# EAGLE schematic distribution_board_f1 (EAGLE 9.0.0)
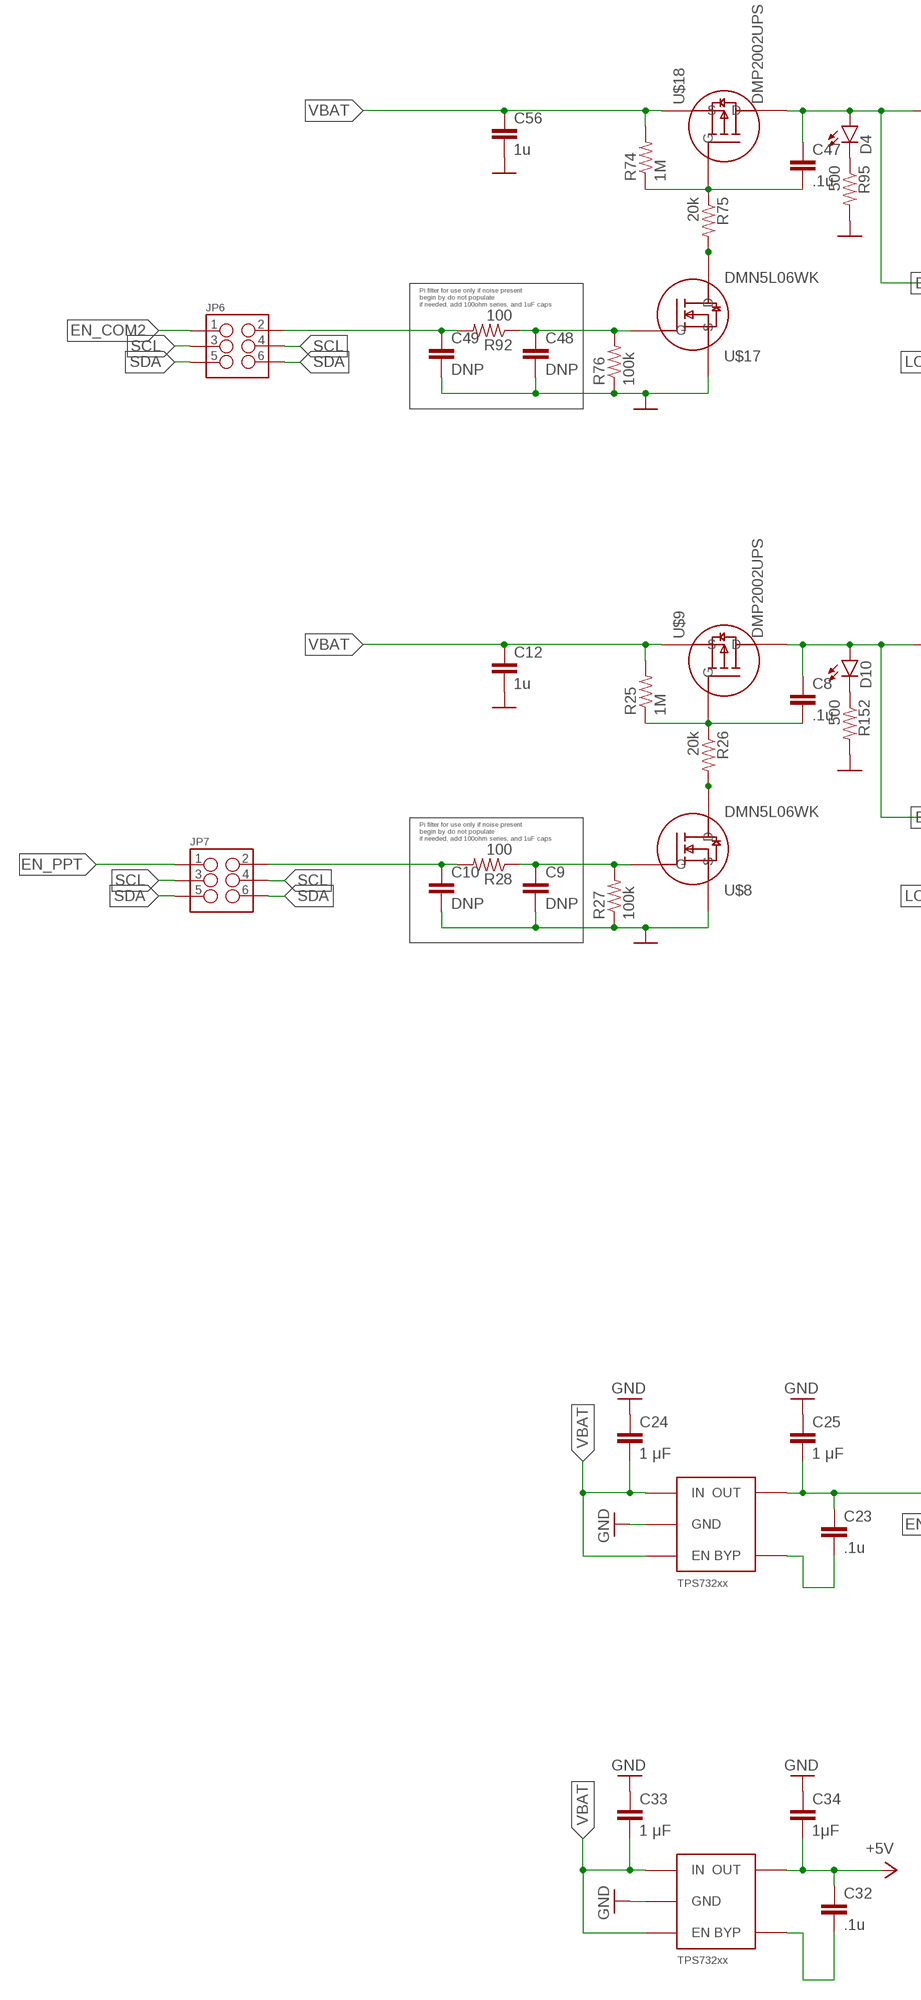
[diagram p0: schematic, sheet 1, part 1 of 3]
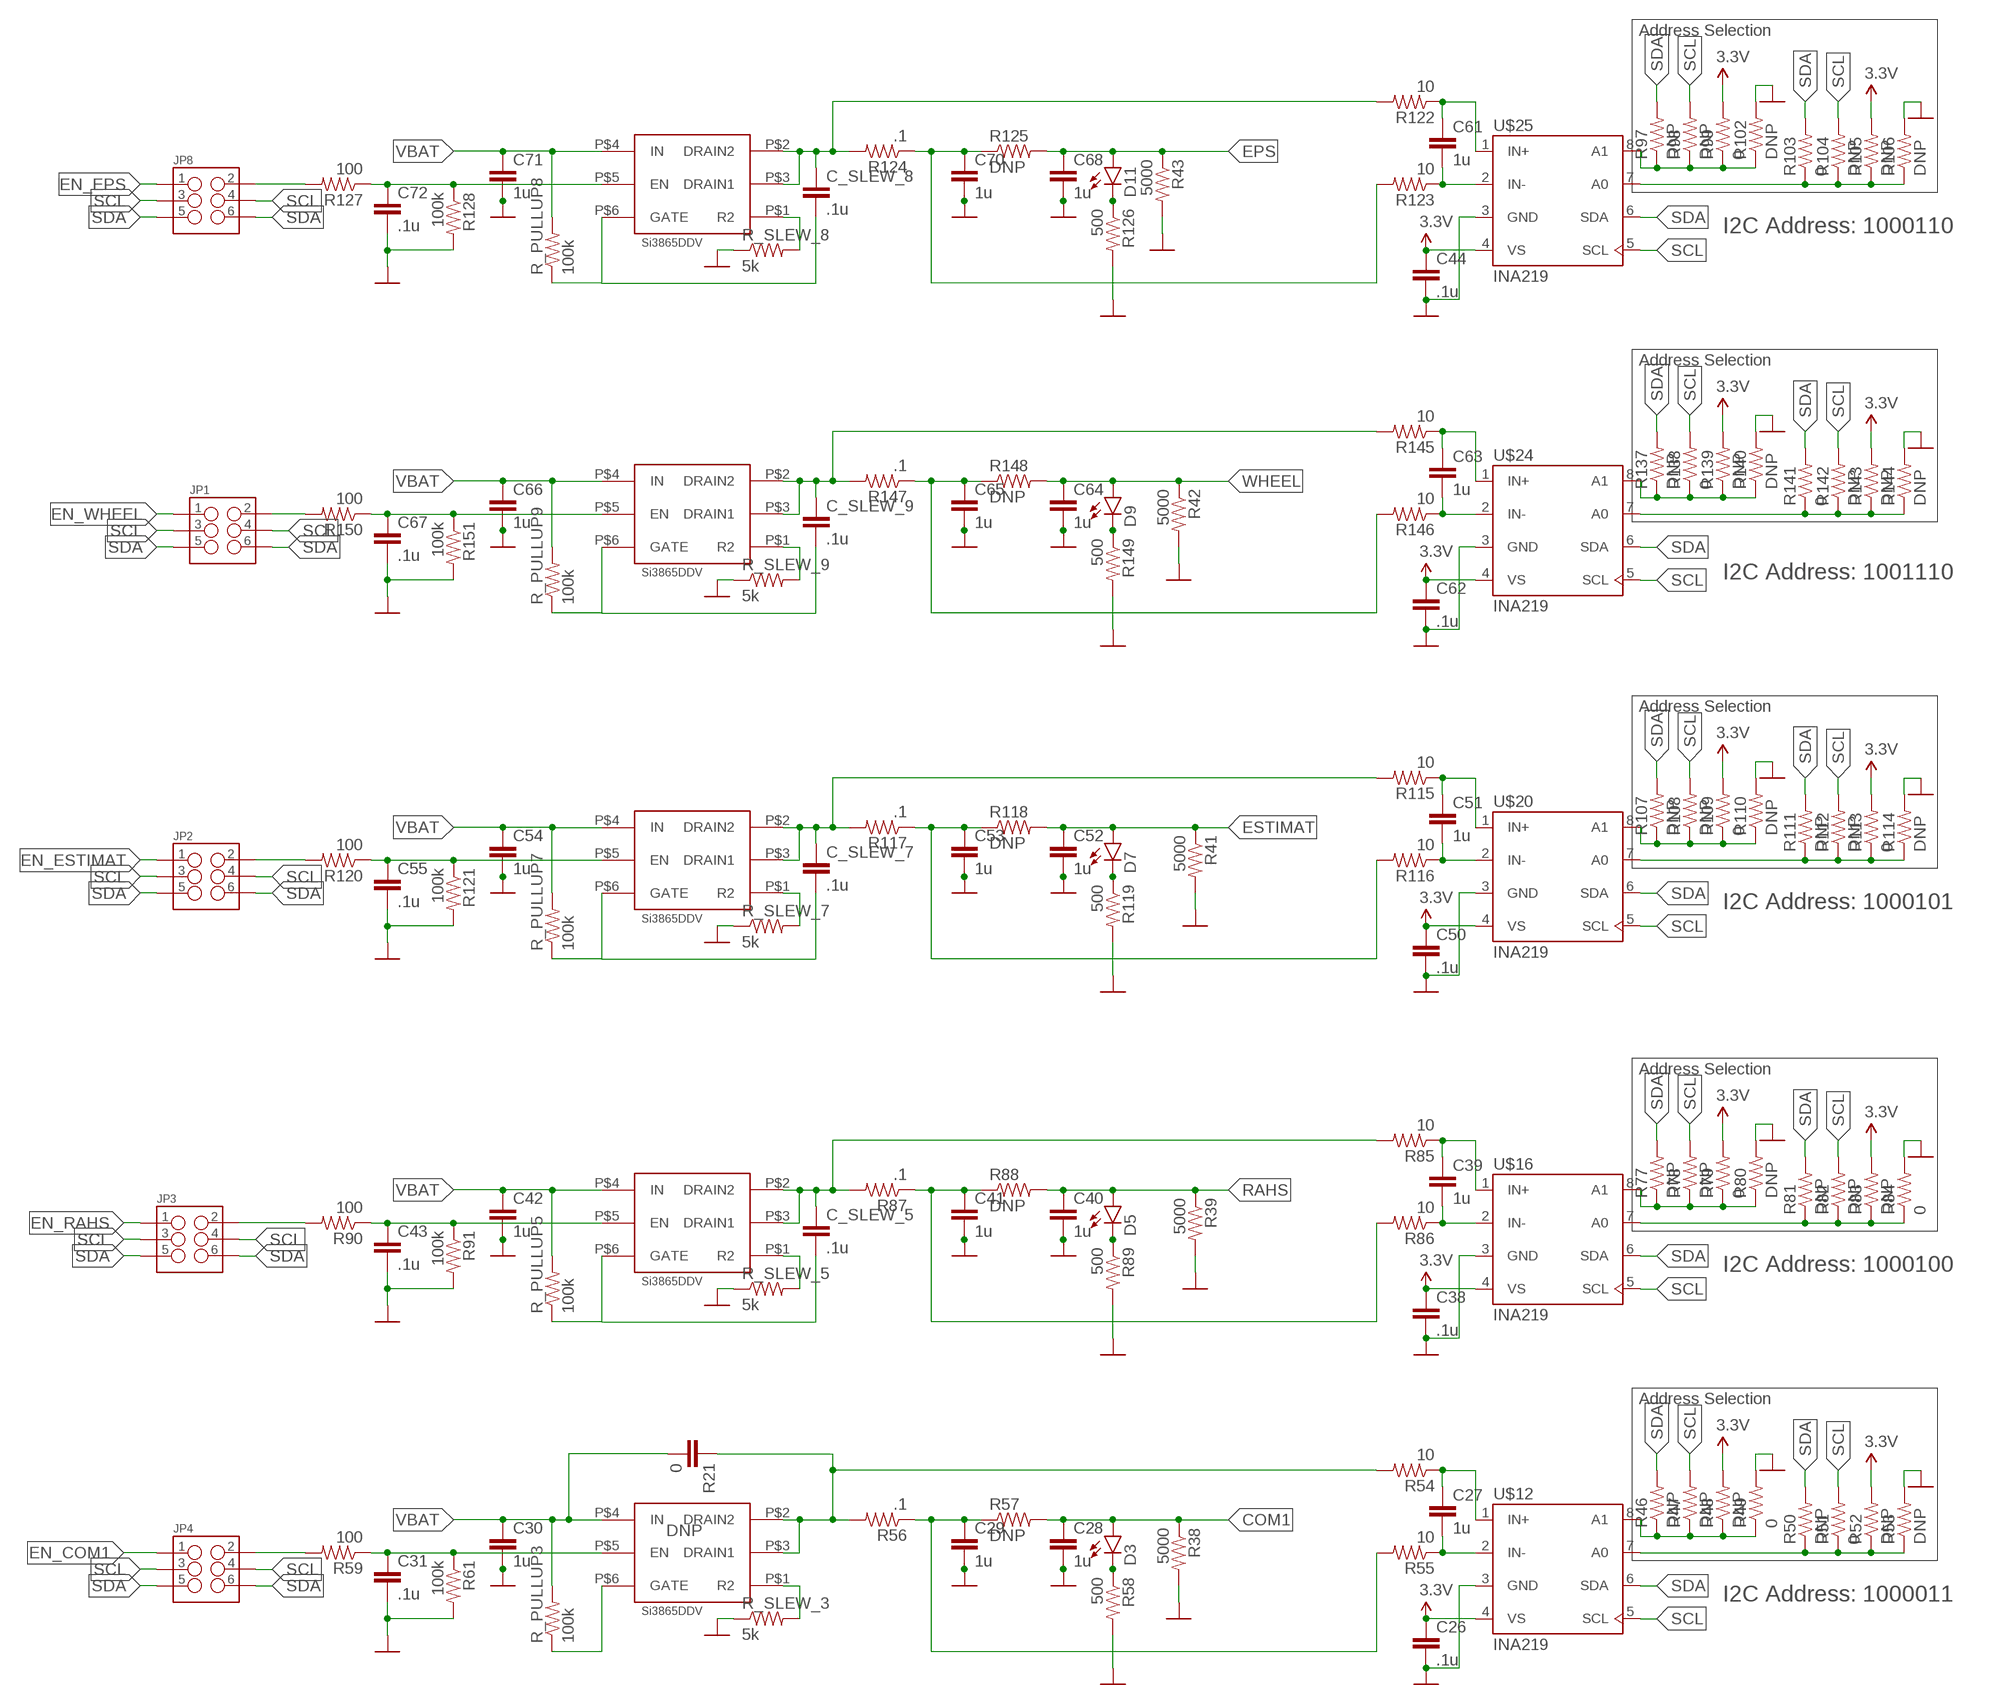
[diagram p1: schematic, sheet 1, part 2 of 3]
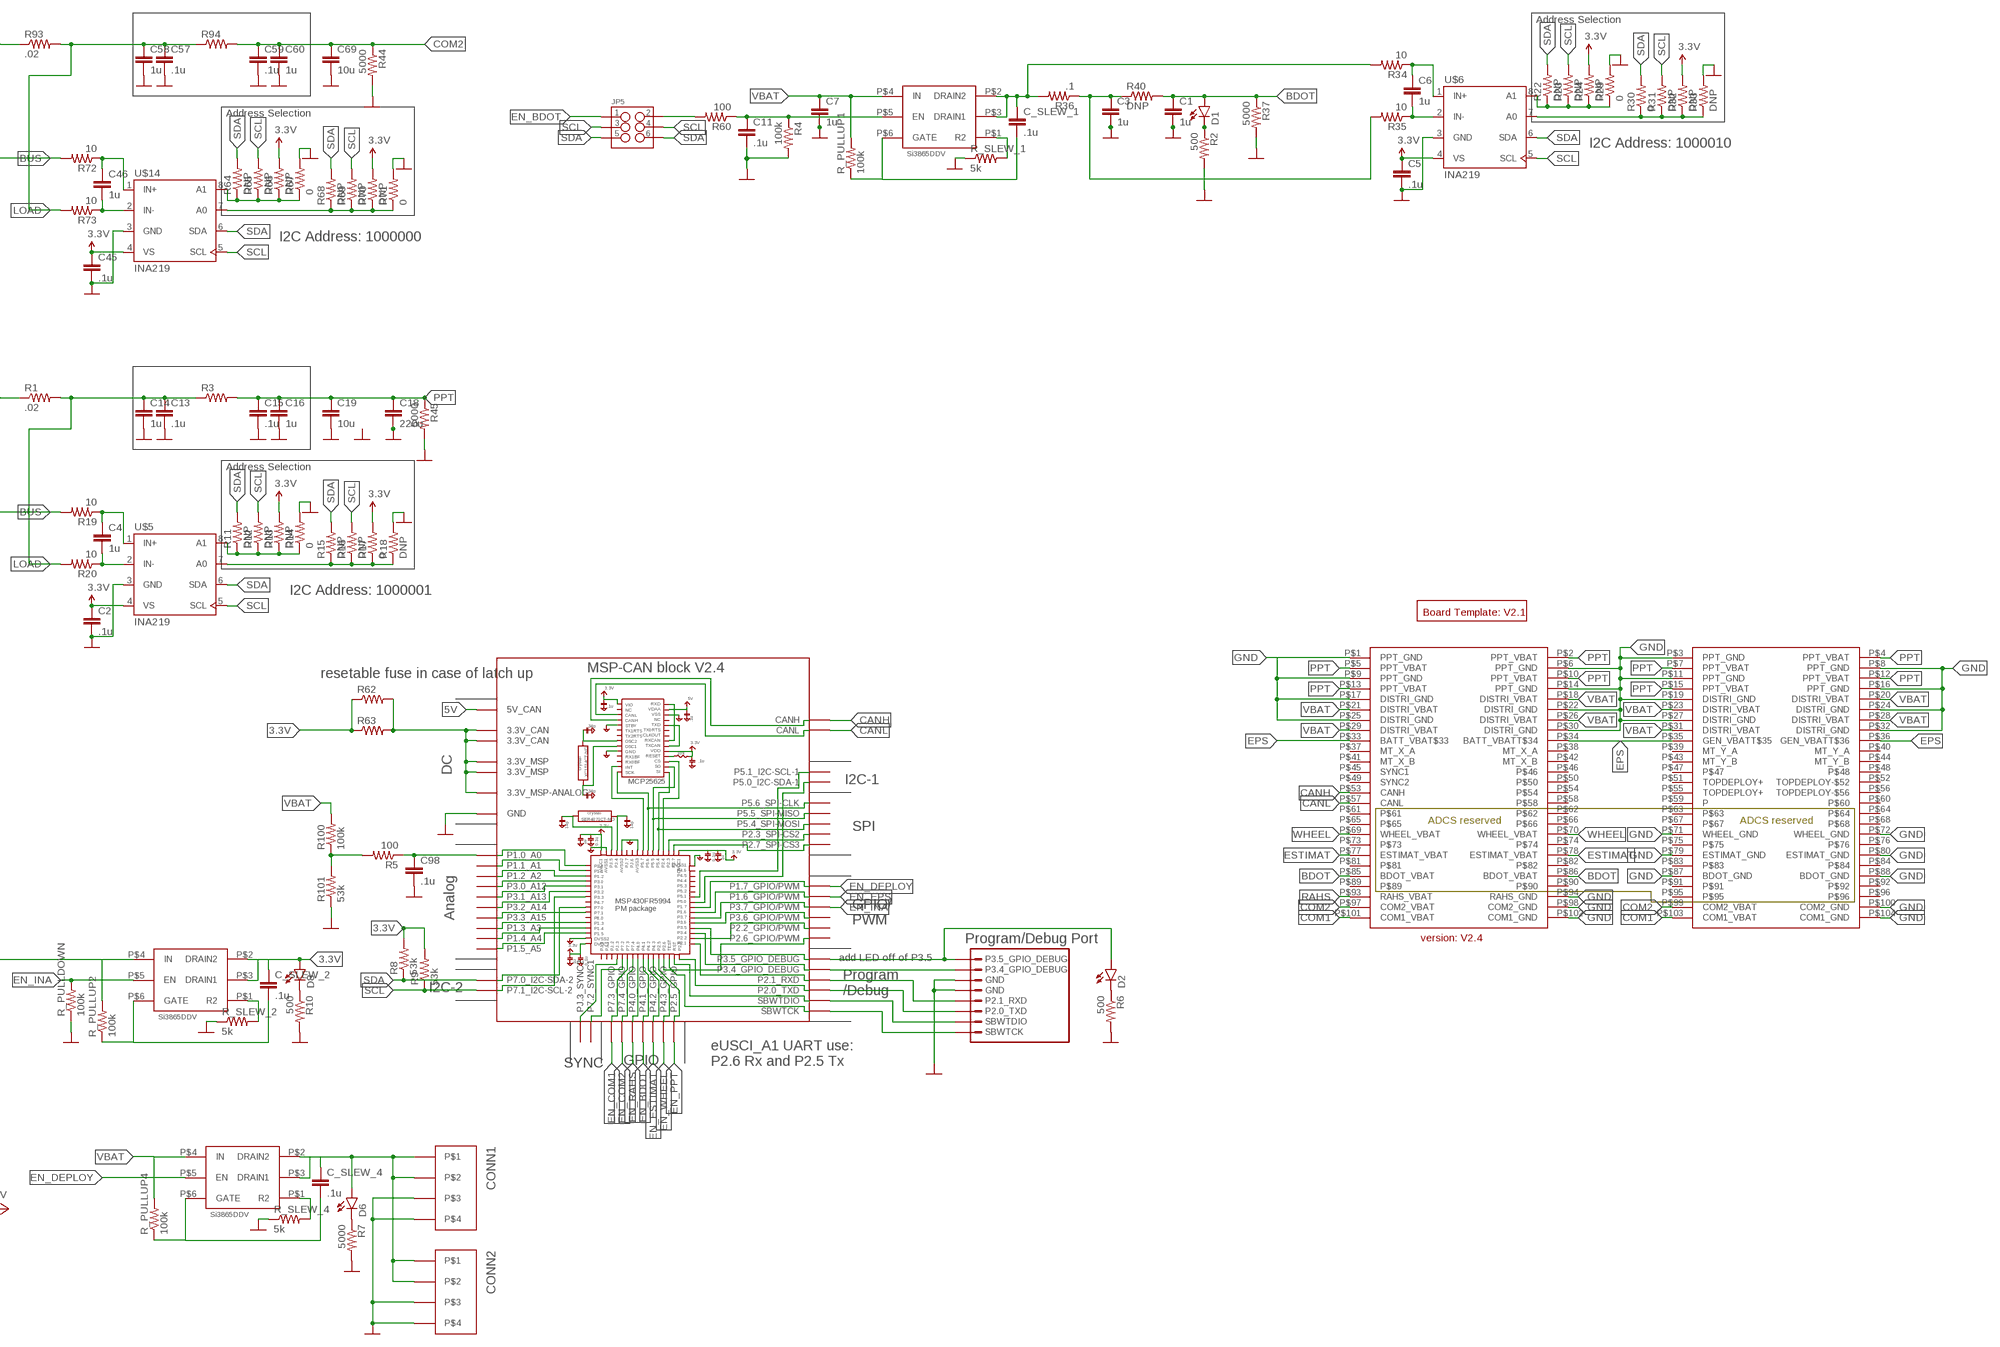
[diagram p2: schematic, sheet 1, part 3 of 3]

## Parts
BLK1  MSP-CAN_BLOCK  [MSP-CAN_BLOCK]
C1  1u  CAPACITOR0805  [0805]
C2  .1u  CAPACITOR0805  [0805]
C3  1u  CAPACITOR0805  [0805]
C4  1u  CAPACITOR0805  [0805]
C5  .1u  CAPACITOR0805  [0805]
C6  1u  CAPACITOR0805  [0805]
C7  1u  CAPACITOR0805  [0805]
C8  .1u  CAPACITOR0805  [0805]
C9  DNP  CAPACITOR0805  [0805]
C10  DNP  CAPACITOR0805  [0805]
C11  .1u  CAPACITOR0805  [0805]
C12  1u  CAPACITOR0805  [0805]
C13  .1u  CAPACITOR0805  [0805]
C14  1u  CAPACITOR0805  [0805]
C15  .1u  CAPACITOR0805  [0805]
C16  1u  CAPACITOR0805  [0805]
C18  220u  CAPACITOR2917  [2917]
C19  10u  CAPACITOR1210  [1210]
C23  .1u  CAPACITOR0805  [0805]
C24  1 μF  CAPACITOR0805  [0805]
C25  1 μF  CAPACITOR0805  [0805]
C26  .1u  CAPACITOR0805  [0805]
C27  1u  CAPACITOR0805  [0805]
C28  1u  CAPACITOR0805  [0805]
C29  1u  CAPACITOR0805  [0805]
C30  1u  CAPACITOR0805  [0805]
C31  .1u  CAPACITOR0805  [0805]
C32  .1u  CAPACITOR0805  [0805]
C33  1 μF  CAPACITOR0805  [0805]
C34  1μF  CAPACITOR0805  [0805]
C38  .1u  CAPACITOR0805  [0805]
C39  1u  CAPACITOR0805  [0805]
C40  1u  CAPACITOR0805  [0805]
C41  1u  CAPACITOR0805  [0805]
C42  1u  CAPACITOR0805  [0805]
C43  .1u  CAPACITOR0805  [0805]
C44  .1u  CAPACITOR0805  [0805]
C45  .1u  CAPACITOR0805  [0805]
C46  1u  CAPACITOR0805  [0805]
C47  .1u  CAPACITOR0805  [0805]
C48  DNP  CAPACITOR0805  [0805]
C49  DNP  CAPACITOR0805  [0805]
C50  .1u  CAPACITOR0805  [0805]
C51  1u  CAPACITOR0805  [0805]
C52  1u  CAPACITOR0805  [0805]
C53  1u  CAPACITOR0805  [0805]
C54  1u  CAPACITOR0805  [0805]
C55  .1u  CAPACITOR0805  [0805]
C56  1u  CAPACITOR0805  [0805]
C57  .1u  CAPACITOR0805  [0805]
C58  1u  CAPACITOR0805  [0805]
C59  .1u  CAPACITOR0805  [0805]
C60  1u  CAPACITOR0805  [0805]
C61  1u  CAPACITOR0805  [0805]
C62  .1u  CAPACITOR0805  [0805]
C63  1u  CAPACITOR0805  [0805]
C64  1u  CAPACITOR0805  [0805]
C65  1u  CAPACITOR0805  [0805]
C66  1u  CAPACITOR0805  [0805]
C67  .1u  CAPACITOR0805  [0805]
C68  1u  CAPACITOR0805  [0805]
C69  10u  CAPACITOR1210  [1210]
C70  1u  CAPACITOR0805  [0805]
C71  1u  CAPACITOR0805  [0805]
C72  .1u  CAPACITOR0805  [0805]
C98  .1u  CAPACITOR0805  [0805]
C_SLEW_1  .1u  CAPACITOR0805  [0805]
C_SLEW_2  .1u  CAPACITOR0805  [0805]
C_SLEW_4  .1u  CAPACITOR0805  [0805]
C_SLEW_5  .1u  CAPACITOR0805  [0805]
C_SLEW_7  .1u  CAPACITOR0805  [0805]
C_SLEW_8  .1u  CAPACITOR0805  [0805]
C_SLEW_9  .1u  CAPACITOR0805  [0805]
CONN1  PICOLOCK_4-LEGACY  [PICOLOCK_4-LEGACY]
CONN2  PICOLOCK_4-LEGACY  [PICOLOCK_4-LEGACY]
D1  LED  [LED-1206]
D2  LED  [LED-1206]
D3  LED  [LED-1206]
D4  LED  [LED-1206]
D5  LED  [LED-1206]
D6  LED  [LED-1206]
D7  LED  [LED-1206]
D8  LED  [LED-1206]
D9  LED  [LED-1206]
D10  LED  [LED-1206]
D11  LED  [LED-1206]
JP1  M03X2NO_SILK  [2X3-NS]
JP2  M03X2NO_SILK  [2X3-NS]
JP3  M03X2NO_SILK  [2X3-NS]
JP4  M03X2NO_SILK  [2X3-NS]
JP5  M03X2NO_SILK  [2X3-NS]
JP6  M03X2NO_SILK  [2X3-NS]
JP7  M03X2NO_SILK  [2X3-NS]
JP8  M03X2NO_SILK  [2X3-NS]
R1  .02  RESISTOR2010  [R2010]
R2  500  RESISTOR0805  [0805]
R3  RESISTOR1206  [1206]
R4  100k  RESISTOR0805  [0805]
R5  100  RESISTOR0805  [0805]
R6  500  RESISTOR0805  [0805]
R7  5000  RESISTOR0805  [0805]
R8  53k  RESISTOR0805  [0805]
R9  53k  RESISTOR0805  [0805]
R10  500  RESISTOR0805  [0805]
R11  DNP  RESISTOR0805  [0805]
R12  DNP  RESISTOR0805  [0805]
R13  DNP  RESISTOR0805  [0805]
R14  0  RESISTOR0805  [0805]
R15  DNP  RESISTOR0805  [0805]
R16  DNP  RESISTOR0805  [0805]
R17  0  RESISTOR0805  [0805]
R18  DNP  RESISTOR0805  [0805]
R19  10  RESISTOR0805  [0805]
R20  10  RESISTOR0805  [0805]
R21  0  CAPACITOR0805  [0805]
R22  DNP  RESISTOR0805  [0805]
R23  DNP  RESISTOR0805  [0805]
R24  DNP  RESISTOR0805  [0805]
R25  1M  RESISTOR0805  [0805]
R26  20k  RESISTOR0805  [0805]
R27  100k  RESISTOR0805  [0805]
R28  100  RESISTOR0805  [0805]
R29  0  RESISTOR0805  [0805]
R30  0  RESISTOR0805  [0805]
R31  DNP  RESISTOR0805  [0805]
R32  DNP  RESISTOR0805  [0805]
R33  DNP  RESISTOR0805  [0805]
R34  10  RESISTOR0805  [0805]
R35  10  RESISTOR0805  [0805]
R36  .1  RESISTOR2010  [R2010]
R37  5000  RESISTOR0805  [0805]
R38  5000  RESISTOR0805  [0805]
R39  5000  RESISTOR0805  [0805]
R40  DNP  RESISTOR0805  [0805]
R41  5000  RESISTOR0805  [0805]
R42  5000  RESISTOR0805  [0805]
R43  5000  RESISTOR0805  [0805]
R44  5000  RESISTOR0805  [0805]
R45  5000  RESISTOR0805  [0805]
R46  DNP  RESISTOR0805  [0805]
R47  DNP  RESISTOR0805  [0805]
R48  DNP  RESISTOR0805  [0805]
R49  0  RESISTOR0805  [0805]
R50  DNP  RESISTOR0805  [0805]
R51  0  RESISTOR0805  [0805]
R52  DNP  RESISTOR0805  [0805]
R53  DNP  RESISTOR0805  [0805]
R54  10  RESISTOR0805  [0805]
R55  10  RESISTOR0805  [0805]
R56  .1  RESISTOR2010  [R2010]
R57  DNP  RESISTOR0805  [0805]
R58  500  RESISTOR0805  [0805]
R59  100  RESISTOR0805  [0805]
R60  100  RESISTOR0805  [0805]
R61  100k  RESISTOR0805  [0805]
R62  RESISTOR0603  [0603]
R63  RESISTOR0805  [0805]
R64  DNP  RESISTOR0805  [0805]
R65  DNP  RESISTOR0805  [0805]
R66  DNP  RESISTOR0805  [0805]
R67  0  RESISTOR0805  [0805]
R68  DNP  RESISTOR0805  [0805]
R69  DNP  RESISTOR0805  [0805]
R70  DNP  RESISTOR0805  [0805]
R71  0  RESISTOR0805  [0805]
R72  10  RESISTOR0805  [0805]
R73  10  RESISTOR0805  [0805]
R74  1M  RESISTOR0805  [0805]
R75  20k  RESISTOR0805  [0805]
R76  100k  RESISTOR0805  [0805]
R77  DNP  RESISTOR0805  [0805]
R78  DNP  RESISTOR0805  [0805]
R79  0  RESISTOR0805  [0805]
R80  DNP  RESISTOR0805  [0805]
R81  DNP  RESISTOR0805  [0805]
R82  DNP  RESISTOR0805  [0805]
R83  DNP  RESISTOR0805  [0805]
R84  0  RESISTOR0805  [0805]
R85  10  RESISTOR0805  [0805]
R86  10  RESISTOR0805  [0805]
R87  .1  RESISTOR2010  [R2010]
R88  DNP  RESISTOR0805  [0805]
R89  500  RESISTOR0805  [0805]
R90  100  RESISTOR0805  [0805]
R91  100k  RESISTOR0805  [0805]
R92  100  RESISTOR0805  [0805]
R93  .02  RESISTOR2010  [R2010]
R94  RESISTOR1206  [1206]
R95  500  RESISTOR0805  [0805]
R97  DNP  RESISTOR0805  [0805]
R98  DNP  RESISTOR0805  [0805]
R99  0  RESISTOR0805  [0805]
R100  100k  RESISTOR0805  [0805]
R101  53k  RESISTOR0805  [0805]
R102  DNP  RESISTOR0805  [0805]
R103  0  RESISTOR0805  [0805]
R104  DNP  RESISTOR0805  [0805]
R105  DNP  RESISTOR0805  [0805]
R106  DNP  RESISTOR0805  [0805]
R107  DNP  RESISTOR0805  [0805]
R108  DNP  RESISTOR0805  [0805]
R109  0  RESISTOR0805  [0805]
R110  DNP  RESISTOR0805  [0805]
R111  DNP  RESISTOR0805  [0805]
R112  DNP  RESISTOR0805  [0805]
R113  0  RESISTOR0805  [0805]
R114  DNP  RESISTOR0805  [0805]
R115  10  RESISTOR0805  [0805]
R116  10  RESISTOR0805  [0805]
R117  .1  RESISTOR2010  [R2010]
R118  DNP  RESISTOR0805  [0805]
R119  500  RESISTOR0805  [0805]
R120  100  RESISTOR0805  [0805]
R121  100k  RESISTOR0805  [0805]
R122  10  RESISTOR0805  [0805]
R123  10  RESISTOR0805  [0805]
R124  .1  RESISTOR2010  [R2010]
R125  DNP  RESISTOR0805  [0805]
R126  500  RESISTOR0805  [0805]
R127  100  RESISTOR0805  [0805]
R128  100k  RESISTOR0805  [0805]
R137  DNP  RESISTOR0805  [0805]
R138  0  RESISTOR0805  [0805]
R139  DNP  RESISTOR0805  [0805]
R140  DNP  RESISTOR0805  [0805]
R141  0  RESISTOR0805  [0805]
R142  DNP  RESISTOR0805  [0805]
R143  DNP  RESISTOR0805  [0805]
R144  DNP  RESISTOR0805  [0805]
R145  10  RESISTOR0805  [0805]
R146  10  RESISTOR0805  [0805]
R147  .1  RESISTOR2010  [R2010]
R148  DNP  RESISTOR0805  [0805]
R149  500  RESISTOR0805  [0805]
R150  100  RESISTOR0805  [0805]
R151  100k  RESISTOR0805  [0805]
R152  500  RESISTOR0805  [0805]
R_PULLDOWN  100k  RESISTOR0805  [0805]
R_PULLUP1  100k  RESISTOR0805  [0805]
R_PULLUP2  100k  RESISTOR0805  [0805]
R_PULLUP3  100k  RESISTOR0805  [0805]
R_PULLUP4  100k  RESISTOR0805  [0805]
R_PULLUP5  100k  RESISTOR0805  [0805]
R_PULLUP7  100k  RESISTOR0805  [0805]
R_PULLUP8  100k  RESISTOR0805  [0805]
R_PULLUP9  100k  RESISTOR0805  [0805]
R_SLEW_1  5k  RESISTOR0805  [0805]
R_SLEW_2  5k  RESISTOR0805  [0805]
R_SLEW_3  5k  RESISTOR0805  [0805]
R_SLEW_4  5k  RESISTOR0805  [0805]
R_SLEW_5  5k  RESISTOR0805  [0805]
R_SLEW_7  5k  RESISTOR0805  [0805]
R_SLEW_8  5k  RESISTOR0805  [0805]
R_SLEW_9  5k  RESISTOR0805  [0805]
U2  TPS732XX  [SOT-23-5]
U3  TPS732XX  [SOT-23-5]
U$1  PROGRAM/DEBUG_PORT  [1X08_CONNECTOR]
U$2  PC104_CONNECTOR  [PC104_CONNECTOR]
U$3  BOARD_TEMPLATE1  [BOARD_TEMPLATE]
U$5  INA219  [SOT-23-8]
U$6  INA219  [SOT-23-8]
U$7  SI3865DDV  [TSOP-6]
U$8  DMN5L06WK  [SOT-323]
U$9  DMP2002UPS  [POWERDI5060-8]
U$10  SI3865DDV  [TSOP-6]
U$11  SI3865DDV  [TSOP-6]
U$12  INA219  [SOT-23-8]
U$13  SI3865DDV  [TSOP-6]
U$14  INA219  [SOT-23-8]
U$15  SI3865DDV  [TSOP-6]
U$16  INA219  [SOT-23-8]
U$17  DMN5L06WK  [SOT-323]
U$18  DMP2002UPS  [POWERDI5060-8]
U$19  SI3865DDV  [TSOP-6]
U$20  INA219  [SOT-23-8]
U$22  SI3865DDV  [TSOP-6]
U$23  SI3865DDV  [TSOP-6]
U$24  INA219  [SOT-23-8]
U$25  INA219  [SOT-23-8]

## Nets
3.3V: BLK1.3.3V@CAN1(3.3V_CAN) BLK1.3.3V@CAN2(3.3V_CAN) BLK1.3.3V@MSP1(3.3V_MSP) BLK1.3.3V@MSP2(3.3V_MSP) BLK1.3.3V_ANALOG@MSP2(3.3V_MSP-ANALOG) C2.1 C5.1 C23.1 C25.2 C26.1 C38.1 C44.1 C45.1 C50.1 C62.1 C_SLEW_2.1 D8.A R8.2 R9.2 R13.2 R17.2 R24.2 R32.2 R48.2 R52.2 R62.1 R62.2 R63.1 R63.2 R66.2 R70.2 R79.2 R83.2 R99.2 R105.2 R109.2 R113.2 R139.2 R143.2 R_PULLUP2.2 U2.P$5(OUT) U$5.4(VS) U$6.4(VS) U$7.P$2(DRAIN2) U$7.P$3(DRAIN1) U$7.P$4(IN) U$12.4(VS) U$14.4(VS) U$16.4(VS) U$20.4(VS) U$24.4(VS) U$25.4(VS)
5V: BLK1.5V(5V_CAN) C32.1 C34.2 U3.P$5(OUT) ; supply symbol labelled +5V
BDOT: C1.1 D1.A R37.1 R40.2 U$2.P$85(BDOT_VBAT) U$2.P$86(BDOT_VBAT)
BUS: C8.1 C47.1 D4.A D10.A R1.1 R19.2 R72.2 R93.1 U$9.D1(D) U$9.D2(D) U$9.D3(D) U$9.D4(D) U$9.D5(D) U$18.D1(D) U$18.D2(D) U$18.D3(D) U$18.D4(D) U$18.D5(D)
CANH: BLK1.CANH U$2.P$53(CANH)
CANL: BLK1.CANL U$2.P$57(CANL)
COM1: C28.1 D3.A R38.1 R57.2 U$2.P$101(COM1_VBAT) U$2.P$103(COM1_VBAT)
COM2: C59.1 C60.1 C69.1 R44.1 R94.2 U$2.P$97(COM2_VBAT) U$2.P$99(COM2_VBAT)
DEPLOY: C_SLEW_4.1 CONN1.P$1 CONN1.P$2 CONN2.P$1 CONN2.P$2 D6.A U$13.P$2(DRAIN2) U$13.P$3(DRAIN1)
EN_BDOT: BLK1.P4.1_GPIO JP5.1 JP5.2 R60.2
EN_COM1: BLK1.P7.3_GPIO JP4.1 JP4.2 R59.2
EN_COM2: BLK1.P7.4_GPIO C49.1 JP6.1 JP6.2 R92.2
EN_DEPLOY: BLK1.P1.7_GPIO/PWM U$13.P$5(EN)
EN_EPS: BLK1.P1.6_GPIO/PWM JP8.1 JP8.2 R127.2
EN_ESTIMAT: BLK1.P4.2_GPIO JP2.1 JP2.2 R120.2
EN_INA: BLK1.P3.7_GPIO/PWM R_PULLDOWN.2 U$7.P$5(EN)
EN_PPT: BLK1.P2.5_GPIO C10.1 JP7.1 JP7.2 R28.2
EN_RAHS: BLK1.P4.0_GPIO JP3.1 JP3.2 R90.2
EN_WHEEL: BLK1.P4.3_GPIO JP1.1 JP1.2 R150.2
EPS: C68.1 D11.A R43.1 R125.2 U$2.P$33(BATT_VBAT$33) U$2.P$34(BATT_VBATT$34) U$2.P$35(GEN_VBATT$35) U$2.P$36(GEN_VBATT$36)
ESTIMAT: C52.1 D7.A R41.1 R118.2 U$2.P$77(ESTIMAT_VBAT) U$2.P$78(ESTIMAT_VBAT)
GND: BLK1.GND@1(GND) BLK1.GND@2(GND) BLK1.GND@3(GND) BLK1.GND@4(GND) BLK1.GND@5(GND) BLK1.GND@7(GND) BLK1.GND@8(GND) BLK1.GND@9(GND) BLK1.GND@10(GND) BLK1.GND@11(GND) BLK1.GND@12(GND) BLK1.GND@13(GND) BLK1.GND@14(GND) BLK1.GND@15(GND) BLK1.GND@16(GND) BLK1.GND@17(GND) BLK1.GND@26(GND) C1.2 C2.2 C3.2 C5.2 C7.2 C9.2 C10.2 C11.2 C12.2 C13.2 C14.2 C15.2 C16.2 C18.2 C19.2 C24.1 C25.1 C26.2 C28.2 C29.2 C30.2 C31.2 C33.1 C34.1 C38.2 C40.2 C41.2 C42.2 C43.2 C44.2 C45.2 C48.2 C49.2 C50.2 C52.2 C53.2 C54.2 C55.2 C56.2 C57.2 C58.2 C59.2 C60.2 C62.2 C64.2 C65.2 C66.2 C67.2 C68.2 C69.2 C70.2 C71.2 C72.2 C98.2 CONN1.P$3 CONN1.P$4 CONN2.P$3 CONN2.P$4 R2.2 R4.2 R6.2 R7.2 R10.2 R14.2 R18.2 R27.1 R29.2 R33.2 R37.2 R38.2 R39.2 R41.2 R42.2 R43.2 R44.2 R45.2 R49.2 R53.2 R58.2 R61.2 R67.2 R71.2 R76.1 R80.2 R84.2 R89.2 R91.2 R95.2 R101.1 R102.2 R106.2 R110.2 R114.2 R119.2 R121.2 R126.2 R128.2 R140.2 R144.2 R149.2 R151.2 R152.2 R_PULLDOWN.1 R_SLEW_1.1 R_SLEW_2.1 R_SLEW_3.1 R_SLEW_4.1 R_SLEW_5.1 R_SLEW_7.1 R_SLEW_8.1 R_SLEW_9.1 U2.P$2(GND) U3.P$2(GND) U$1.5(GND) U$1.6(GND) U$2.P$1(PPT_GND) U$2.P$3(PPT_GND) U$2.P$6(PPT_GND) U$2.P$8(PPT_GND) U$2.P$9(PPT_GND) U$2.P$11(PPT_GND) U$2.P$14(PPT_GND) U$2.P$16(PPT_GND) U$2.P$17(DISTRI_GND) U$2.P$19(DISTRI_GND) U$2.P$22(DISTRI_GND) U$2.P$24(DISTRI_GND) U$2.P$27(DISTRI_GND) U$2.P$30(DISTRI_GND) U$2.P$32(DISTRI_GND) U$2.P$71(WHEEL_GND) U$2.P$72(WHEEL_GND) U$2.P$79(ESTIMAT_GND) U$2.P$80(ESTIMAT_GND) U$2.P$87(BDOT_GND) U$2.P$88(BDOT_GND) U$2.P$94(RAHS_GND) U$2.P$98(COM2_GND) U$2.P$100(COM2_GND) U$2.P$102(COM1_GND) U$2.P$104(COM1_GND) U$5.3(GND) U$6.3(GND) U$8.2(S) U$12.3(GND) U$14.3(GND) U$16.3(GND) U$17.2(S) U$20.3(GND) U$24.3(GND) U$25.3(GND) ; supply symbol labelled DGND
INA219_A0_1: R15.1 R16.1 R17.1 R18.1 U$5.7(A0)
INA219_A0_2: R30.1 R31.1 R32.1 R33.1 U$6.7(A0)
INA219_A0_4: R50.1 R51.1 R52.1 R53.1 U$12.7(A0)
INA219_A0_5: R68.1 R69.1 R70.1 R71.1 U$14.7(A0)
INA219_A0_6: R81.1 R82.1 R83.1 R84.1 U$16.7(A0)
INA219_A0_7: R103.1 R104.1 R105.1 R106.1 U$25.7(A0)
INA219_A0_8: R111.1 R112.1 R113.1 R114.1 U$20.7(A0)
INA219_A0_10: R141.1 R142.1 R143.1 R144.1 U$24.7(A0)
INA219_A1_1: R11.1 R12.1 R13.1 R14.1 U$5.8(A1)
INA219_A1_2: R22.1 R23.1 R24.1 R29.1 U$6.8(A1)
INA219_A1_4: R46.1 R47.1 R48.1 R49.1 U$12.8(A1)
INA219_A1_5: R64.1 R65.1 R66.1 R67.1 U$14.8(A1)
INA219_A1_6: R77.1 R78.1 R79.1 R80.1 U$16.8(A1)
INA219_A1_7: R97.1 R98.1 R99.1 R102.1 U$25.8(A1)
INA219_A1_8: R107.1 R108.1 R109.1 R110.1 U$20.8(A1)
INA219_A1_10: R137.1 R138.1 R139.1 R140.1 U$24.8(A1)
INA219_IN+_1: C4.1 R19.1 U$5.1(IN+)
INA219_IN+_2: C6.1 R34.1 U$6.1(IN+)
INA219_IN+_4: C27.1 R54.1 U$12.1(IN+)
INA219_IN+_5: C46.1 R72.1 U$14.1(IN+)
INA219_IN+_6: C39.1 R85.1 U$16.1(IN+)
INA219_IN+_7: C61.1 R122.1 U$25.1(IN+)
INA219_IN+_8: C51.1 R115.1 U$20.1(IN+)
INA219_IN+_10: C63.1 R145.1 U$24.1(IN+)
INA219_IN-_1: C4.2 R20.1 U$5.2(IN-)
INA219_IN-_2: C6.2 R35.1 U$6.2(IN-)
INA219_IN-_4: C27.2 R55.1 U$12.2(IN-)
INA219_IN-_5: C46.2 R73.1 U$14.2(IN-)
INA219_IN-_6: C39.2 R86.1 U$16.2(IN-)
INA219_IN-_7: C61.2 R123.1 U$25.2(IN-)
INA219_IN-_8: C51.2 R116.1 U$20.2(IN-)
INA219_IN-_10: C63.2 R146.1 U$24.2(IN-)
LDO_3V3_BYP2: C23.2 U2.P$4(BYP)
LDO_5V_BYP2: C32.2 U3.P$4(BYP)
LOAD: C13.1 C14.1 C57.1 C58.1 R1.2 R3.1 R20.2 R73.2 R93.2 R94.1
N$1: C8.2 R25.1 R26.1 U$9.G
N$2: C9.1 R27.2 R28.1 U$8.1(G)
N$3: D1.C R2.1
N$4: C11.1 R4.1 R60.1 U$11.P$5(EN)
N$5: R5.2 R100.1 R101.2
N$6: R26.2 U$8.3(D)
N$7: BLK1.P1.0_A0 C98.1 R5.1
N$8: R_SLEW_2.2 U$7.P$1(R2)
N$9: R_SLEW_1.2 U$11.P$1(R2)
N$10: C_SLEW_1.2 R_PULLUP1.1 U$11.P$6(GATE)
N$11: C_SLEW_2.2 R_PULLUP2.1 U$7.P$6(GATE)
N$12: R_SLEW_3.2 U$10.P$1(R2)
N$13: R_PULLUP3.1 U$10.P$6(GATE)
N$14: D3.C R58.1
N$15: C31.1 R59.1 R61.1 U$10.P$5(EN)
N$16: C47.2 R74.1 R75.1 U$18.G
N$17: C48.1 R76.2 R92.1 U$17.1(G)
N$18: R75.2 U$17.3(D)
N$19: D4.C R95.1
N$20: R_SLEW_5.2 U$15.P$1(R2)
N$21: C_SLEW_5.2 R_PULLUP5.1 U$15.P$6(GATE)
N$22: D5.C R89.1
N$23: C43.1 R90.1 R91.1 U$15.P$5(EN)
N$24: BLK1.P3.5_GPIO_DEBUG D2.A U$1.8(P3.5_GPIO_DEBUG)
N$25: BLK1.P3.4_GPIO_DEBUG U$1.7(P3.4_GPIO_DEBUG)
N$26: BLK1.P2.1_RXD U$1.4(P2.1_RXD)
N$27: BLK1.P2.0_TXD U$1.3(P2.0_TXD)
N$28: R_SLEW_7.2 U$19.P$1(R2)
N$29: C_SLEW_7.2 R_PULLUP7.1 U$19.P$6(GATE)
N$30: D7.C R119.1
N$31: C55.1 R120.1 R121.1 U$19.P$5(EN)
N$32: BLK1.SBWTDIO U$1.2(SBWTDIO)
N$33: BLK1.SBWTCK U$1.SBWTCK
N$34: R_SLEW_4.2 U$13.P$1(R2)
N$35: C_SLEW_4.2 R_PULLUP4.1 U$13.P$6(GATE)
N$36: R_SLEW_9.2 U$23.P$1(R2)
N$37: C_SLEW_9.2 R_PULLUP9.1 U$23.P$6(GATE)
N$38: D9.C R149.1
N$39: C67.1 R150.1 R151.1 U$23.P$5(EN)
N$40: D10.C R152.1
N$43: D2.C R6.1
N$44: D8.C R10.1
N$45: D6.C R7.1
N$48: U$2.P$25(DISTRI_GND)
N$50: R_SLEW_8.2 U$22.P$1(R2)
N$51: C_SLEW_8.2 R_PULLUP8.1 U$22.P$6(GATE)
N$52: D11.C R126.1
N$53: C72.1 R127.1 R128.1 U$22.P$5(EN)
OUT_1: C_SLEW_1.1 R34.2 R36.2 U$11.P$2(DRAIN2) U$11.P$3(DRAIN1)
OUT_3: R21.1 R54.2 R56.2 U$10.P$2(DRAIN2) U$10.P$3(DRAIN1)
OUT_4: C_SLEW_8.1 R122.2 R124.2 U$22.P$2(DRAIN2) U$22.P$3(DRAIN1)
OUT_5: C_SLEW_5.1 R85.2 R87.2 U$15.P$2(DRAIN2) U$15.P$3(DRAIN1)
OUT_7: C_SLEW_7.1 R115.2 R117.2 U$19.P$2(DRAIN2) U$19.P$3(DRAIN1)
OUT_9: C_SLEW_9.1 R145.2 R147.2 U$23.P$2(DRAIN2) U$23.P$3(DRAIN1)
OUTPUT1: C3.1 R35.2 R36.1 R40.1
OUTPUT3: C29.1 R55.2 R56.1 R57.1
OUTPUT4: C70.1 R123.2 R124.1 R125.1
OUTPUT5: C41.1 R86.2 R87.1 R88.1
OUTPUT7: C53.1 R116.2 R117.1 R118.1
OUTPUT9: C65.1 R146.2 R147.1 R148.1
PPT: C15.1 C16.1 C18.1 C19.1 R3.2 R45.1 U$2.P$2(PPT_VBAT) U$2.P$4(PPT_VBAT) U$2.P$5(PPT_VBAT) U$2.P$7(PPT_VBAT) U$2.P$10(PPT_VBAT) U$2.P$12(PPT_VBAT) U$2.P$13(PPT_VBAT) U$2.P$15(PPT_VBAT)
RAHS: C40.1 D5.A R39.1 R88.2 U$2.P$93(RAHS_VBAT)
SCL: BLK1.P7.1_I2C-SCL-2 JP1.3 JP1.4 JP2.3 JP2.4 JP3.3 JP3.4 JP4.3 JP4.4 JP5.3 JP5.4 JP6.3 JP6.4 JP7.3 JP7.4 JP8.3 JP8.4 R9.1 R12.2 R16.2 R23.2 R31.2 R47.2 R51.2 R65.2 R69.2 R78.2 R82.2 R98.2 R104.2 R108.2 R112.2 R138.2 R142.2 U$5.5(SCL) U$6.5(SCL) U$12.5(SCL) U$14.5(SCL) U$16.5(SCL) U$20.5(SCL) U$24.5(SCL) U$25.5(SCL)
SDA: BLK1.P7.0_I2C-SDA-2 JP1.5 JP1.6 JP2.5 JP2.6 JP3.5 JP3.6 JP4.5 JP4.6 JP5.5 JP5.6 JP6.5 JP6.6 JP7.5 JP7.6 JP8.5 JP8.6 R8.1 R11.2 R15.2 R22.2 R30.2 R46.2 R50.2 R64.2 R68.2 R77.2 R81.2 R97.2 R103.2 R107.2 R111.2 R137.2 R141.2 U$5.6(SDA) U$6.6(SDA) U$12.6(SDA) U$14.6(SDA) U$16.6(SDA) U$20.6(SDA) U$24.6(SDA) U$25.6(SDA)
VBAT: C7.1 C12.1 C24.2 C30.1 C33.2 C42.1 C54.1 C56.1 C66.1 C71.1 R21.2 R25.2 R74.2 R100.2 R_PULLUP1.2 R_PULLUP3.2 R_PULLUP4.2 R_PULLUP5.2 R_PULLUP7.2 R_PULLUP8.2 R_PULLUP9.2 U2.P$1(IN) U2.P$3(EN) U3.P$1(IN) U3.P$3(EN) U$2.P$18(DISTRI_VBAT) U$2.P$20(DISTRI_VBAT) U$2.P$21(DISTRI_VBAT) U$2.P$23(DISTRI_VBAT) U$2.P$26(DISTRI_VBAT) U$2.P$28(DISTRI_VBAT) U$2.P$29(DISTRI_VBAT) U$2.P$31(DISTRI_VBAT) U$9.S1(S) U$9.S2(S) U$9.S3(S) U$10.P$4(IN) U$11.P$4(IN) U$13.P$4(IN) U$15.P$4(IN) U$18.S1(S) U$18.S2(S) U$18.S3(S) U$19.P$4(IN) U$22.P$4(IN) U$23.P$4(IN)
WHEEL: C64.1 D9.A R42.1 R148.2 U$2.P$69(WHEEL_VBAT) U$2.P$70(WHEEL_VBAT)
Unconnected: BLK1.P1.1_A1 BLK1.P1.2_A2 BLK1.P1.3_A3 BLK1.P1.4_A4 BLK1.P1.5_A5 BLK1.P2.2_GPIO/PWM BLK1.P2.4_SPI-CS2(P2.3_SPI-CS2) BLK1.P2.6_GPIO/PWM BLK1.P2.7_SPI-CS3 BLK1.P3.0_A12 BLK1.P3.1_A13 BLK1.P3.2_A14 BLK1.P3.3_A15 BLK1.P3.6_GPIO/PWM BLK1.P5.0_I2C-SDA-1 BLK1.P5.1_I2C-SCL-1 BLK1.P5.4_SPI-MOSI BLK1.P5.5_SPI-MISO BLK1.P5.6_SPI-CLK BLK1.P7.2_SYNC1 BLK1.PJ.3_SYNC2 U$2.P$37(MT_X_A) U$2.P$38(MT_X_A) U$2.P$39(MT_Y_A) U$2.P$40(MT_Y_A) U$2.P$41(MT_X_B) U$2.P$42(MT_X_B) U$2.P$43(MT_Y_B) U$2.P$44(MT_Y_B) U$2.P$45(SYNC1) U$2.P$46 U$2.P$47 U$2.P$48 U$2.P$49(SYNC2) U$2.P$50 U$2.P$51(TOPDEPLOY+) U$2.P$52(TOPDEPLOY-$52) U$2.P$54 U$2.P$55(TOPDEPLOY+) U$2.P$56(TOPDEPLOY-$56) U$2.P$58 U$2.P$59(P) U$2.P$60 U$2.P$61 U$2.P$62 U$2.P$63 U$2.P$64 U$2.P$65 U$2.P$66 U$2.P$67 U$2.P$68 U$2.P$73 U$2.P$74 U$2.P$75 U$2.P$76 U$2.P$81 U$2.P$82 U$2.P$83 U$2.P$84 U$2.P$89 U$2.P$90 U$2.P$91 U$2.P$92 U$2.P$95 U$2.P$96

## Notes on the sheet
- Address Selection
- I2C Address: 1000110
- Address Selection
- I2C Address: 1001110
- Address Selection
- I2C Address: 1000101
- Address Selection
- I2C Address: 1000100
- Address Selection
- DNP
- I2C Address: 1000011
- Address Selection
- Address Selection
- I2C Address: 1000010
- Pi filter for use only if noise present
  begin by do not populate
  if needed, add 100ohm series, and 1uF caps
- I2C Address: 1000000
- Address Selection
- Pi filter for use only if noise present
  begin by do not populate
  if needed, add 100ohm series, and 1uF caps
- I2C Address: 1000001
- resetable fuse in case of latch up

## Library data of the parts
BLK1 = DubSat1 Components:MSP-CAN_BLOCK
C1-C16 C18 C19 C23-C34 C38-C72 C98 C_SLEW_1 C_SLEW_2 C_SLEW_4 C_SLEW_5 C_SLEW_7-C_SLEW_9 R21 = DubSat1 Components:CAPACITOR: Capacitor Standard 0603 ceramic capacitor, and 0.1" leaded capacitor.
CONN1 CONN2 = DubSat1 Components:PICOLOCK_4-LEGACY
D1-D11 = DubSat1 Components:LED
JP1-JP8 = SparkFun-Connectors:M03X2: 2x3 .1" header. Shrouded, with keying- CONN-10681 SMT- CONN-11415 Pogo pins- HW-11044
R1-R20 R22-R95 R97-R128 R137-R152 R_PULLDOWN R_PULLUP1-R_PULLUP5 R_PULLUP7-R_PULLUP9 R_SLEW_1-R_SLEW_5 R_SLEW_7-R_SLEW_9 = DubSat1 Components:RESISTOR: Resistor Basic schematic elements and footprints for 0603, 1206, and PTH resistors.
U2 U3 = DubSat1 Components:TPS732XX
U$1 = DubSat1 Components:PROGRAM/DEBUG_PORT
U$2 = DubSat1 Components:PC104_CONNECTOR
U$3 = DubSat1 Components:BOARD_TEMPLATE
U$5 U$6 U$12 U$14 U$16 U$20 U$24 U$25 = DubSat1 Components:INA219
U$7 U$10 U$11 U$13 U$15 U$19 U$22 U$23 = DubSat1 Components:SI3865DDV
U$8 U$17 = DubSat1 Components:DMN5L06WK
U$9 U$18 = DubSat1 Components:DMP2002UPS